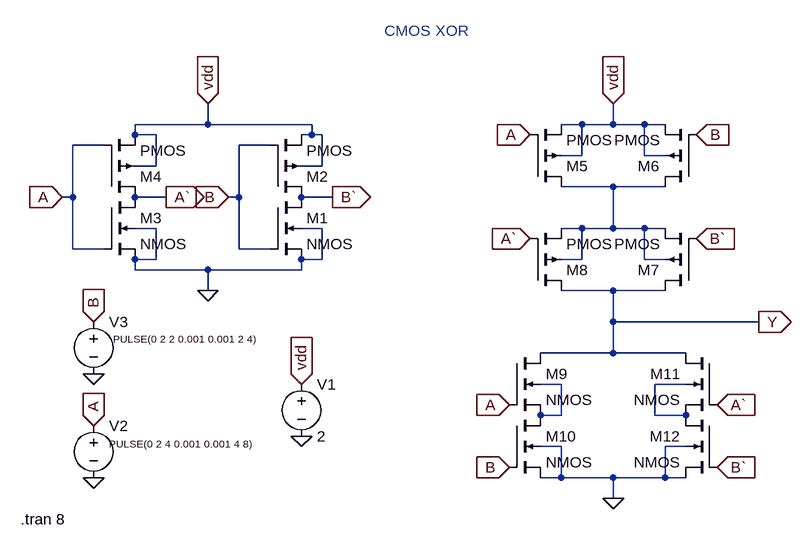
[diagram p0: schematic CMOS XOR.asc]
CMOS XOR.asc, the LTspice schematic file:
Version 4
SHEET 1 1532 680
WIRE 256 48 256 16
WIRE 256 48 144 48
WIRE 416 48 256 48
WIRE 832 48 800 48
WIRE 880 48 880 16
WIRE 880 48 832 48
WIRE 928 48 880 48
WIRE 960 48 928 48
WIRE 144 64 144 48
WIRE 176 64 144 64
WIRE 416 64 416 48
WIRE 416 64 400 64
WIRE 432 64 416 64
WIRE 96 80 48 80
WIRE 352 80 304 80
WIRE 832 96 832 48
WIRE 832 96 800 96
WIRE 928 96 928 48
WIRE 960 96 928 96
WIRE 176 112 176 64
WIRE 176 112 144 112
WIRE 432 112 432 64
WIRE 432 112 400 112
WIRE 880 144 800 144
WIRE 960 144 880 144
WIRE 48 160 48 80
WIRE 48 160 32 160
WIRE 192 160 144 160
WIRE 304 160 304 80
WIRE 304 160 288 160
WIRE 448 160 400 160
WIRE 176 208 144 208
WIRE 432 208 400 208
WIRE 832 208 800 208
WIRE 880 208 880 144
WIRE 880 208 832 208
WIRE 928 208 880 208
WIRE 960 208 928 208
WIRE 48 240 48 160
WIRE 96 240 48 240
WIRE 304 240 304 160
WIRE 352 240 304 240
WIRE 176 256 176 208
WIRE 176 256 144 256
WIRE 432 256 432 208
WIRE 432 256 400 256
WIRE 832 256 832 208
WIRE 832 256 800 256
WIRE 928 256 928 208
WIRE 960 256 928 256
WIRE 144 272 144 256
WIRE 256 272 144 272
WIRE 400 272 400 256
WIRE 400 272 256 272
WIRE 256 304 256 272
WIRE 880 304 800 304
WIRE 960 304 880 304
WIRE 880 352 880 304
WIRE 1104 352 880 352
WIRE 880 400 880 352
WIRE 880 400 768 400
WIRE 992 400 880 400
WIRE 800 448 768 448
WIRE 992 448 944 448
WIRE 800 496 800 448
WIRE 800 496 768 496
WIRE 944 496 944 448
WIRE 992 496 944 496
WIRE 800 544 768 544
WIRE 992 544 960 544
WIRE 800 592 800 544
WIRE 800 592 768 592
WIRE 880 592 800 592
WIRE 960 592 960 544
WIRE 960 592 880 592
WIRE 992 592 960 592
WIRE 880 624 880 592
FLAG 192 160 A`
IOPIN 192 160 Out
FLAG 448 160 B`
IOPIN 448 160 Out
FLAG 880 16 vdd
IOPIN 880 16 In
FLAG 752 64 A
IOPIN 752 64 In
FLAG 80 512 A
IOPIN 80 512 In
FLAG 80 352 B
IOPIN 80 352 In
FLAG 400 448 vdd
IOPIN 400 448 In
FLAG 880 624 0
FLAG 400 528 0
FLAG 80 592 0
FLAG 80 432 0
FLAG 256 16 vdd
IOPIN 256 16 In
FLAG 256 304 0
FLAG 32 160 A
IOPIN 32 160 In
FLAG 288 160 B
IOPIN 288 160 In
FLAG 1104 352 Y
IOPIN 1104 352 Out
FLAG 1008 64 B
IOPIN 1008 64 In
FLAG 720 576 B
IOPIN 720 576 In
FLAG 752 224 A`
IOPIN 752 224 In
FLAG 1040 480 A`
IOPIN 1040 480 In
FLAG 1008 224 B`
IOPIN 1008 224 In
FLAG 1040 576 B`
IOPIN 1040 576 In
FLAG 720 480 A
IOPIN 720 480 In
SYMBOL nmos4 352 160 R0
SYMATTR InstName M1
SYMBOL pmos4 352 160 M180
SYMATTR InstName M2
SYMBOL nmos4 96 160 R0
SYMATTR InstName M3
SYMBOL pmos4 96 160 M180
SYMATTR InstName M4
SYMBOL pmos4 752 144 M180
SYMATTR InstName M5
SYMBOL pmos4 1008 144 R180
SYMATTR InstName M6
SYMBOL pmos4 1008 304 R180
SYMATTR InstName M7
SYMBOL pmos4 752 304 M180
SYMATTR InstName M8
SYMBOL nmos4 720 400 R0
SYMATTR InstName M9
SYMBOL nmos4 720 496 R0
SYMATTR InstName M10
SYMBOL nmos4 1040 400 M0
SYMATTR InstName M11
SYMBOL nmos4 1040 496 M0
SYMATTR InstName M12
SYMBOL voltage 400 432 R0
WINDOW 123 0 0 Left 0
WINDOW 39 0 0 Left 0
SYMATTR InstName V1
SYMATTR Value 2
SYMBOL voltage 80 496 R0
WINDOW 3 24 44 Left 1
WINDOW 123 0 0 Left 0
WINDOW 39 0 0 Left 0
SYMATTR Value PULSE(0 2 4 0.001 0.001 4 8)
SYMATTR InstName V2
SYMBOL voltage 80 336 R0
WINDOW 3 138 53 Bottom 1
WINDOW 123 0 0 Left 0
WINDOW 39 0 0 Left 0
SYMATTR Value PULSE(0 2 2 0.001 0.001 2 4)
SYMATTR InstName V3
TEXT -32 656 Left 2 !.tran 8
TEXT 528 -96 Left 2 ;CMOS XOR

The netlist it stands for:
* CMOS XOR.asc
M1 B` B 0 0 NMOS
M2 B` B vdd vdd PMOS
M3 A` A 0 0 NMOS
M4 A` A vdd vdd PMOS
M5 N001 A vdd vdd PMOS
M6 N001 B vdd vdd PMOS
M7 Y B` N001 N001 PMOS
M8 Y A` N001 N001 PMOS
M9 Y A N002 N002 NMOS
M10 N002 B 0 0 NMOS
M11 Y A` N003 N003 NMOS
M12 N003 B` 0 0 NMOS
V1 vdd 0 2
V2 A 0 PULSE(0 2 4 0.001 0.001 4 8)
V3 B 0 PULSE(0 2 2 0.001 0.001 2 4)
.model NMOS NMOS
.model PMOS PMOS
.lib standard.mos
.tran 8
* CMOS XOR
.backanno
.end